# EAGLE schematic ClockMaster (EAGLE 7.7.0)
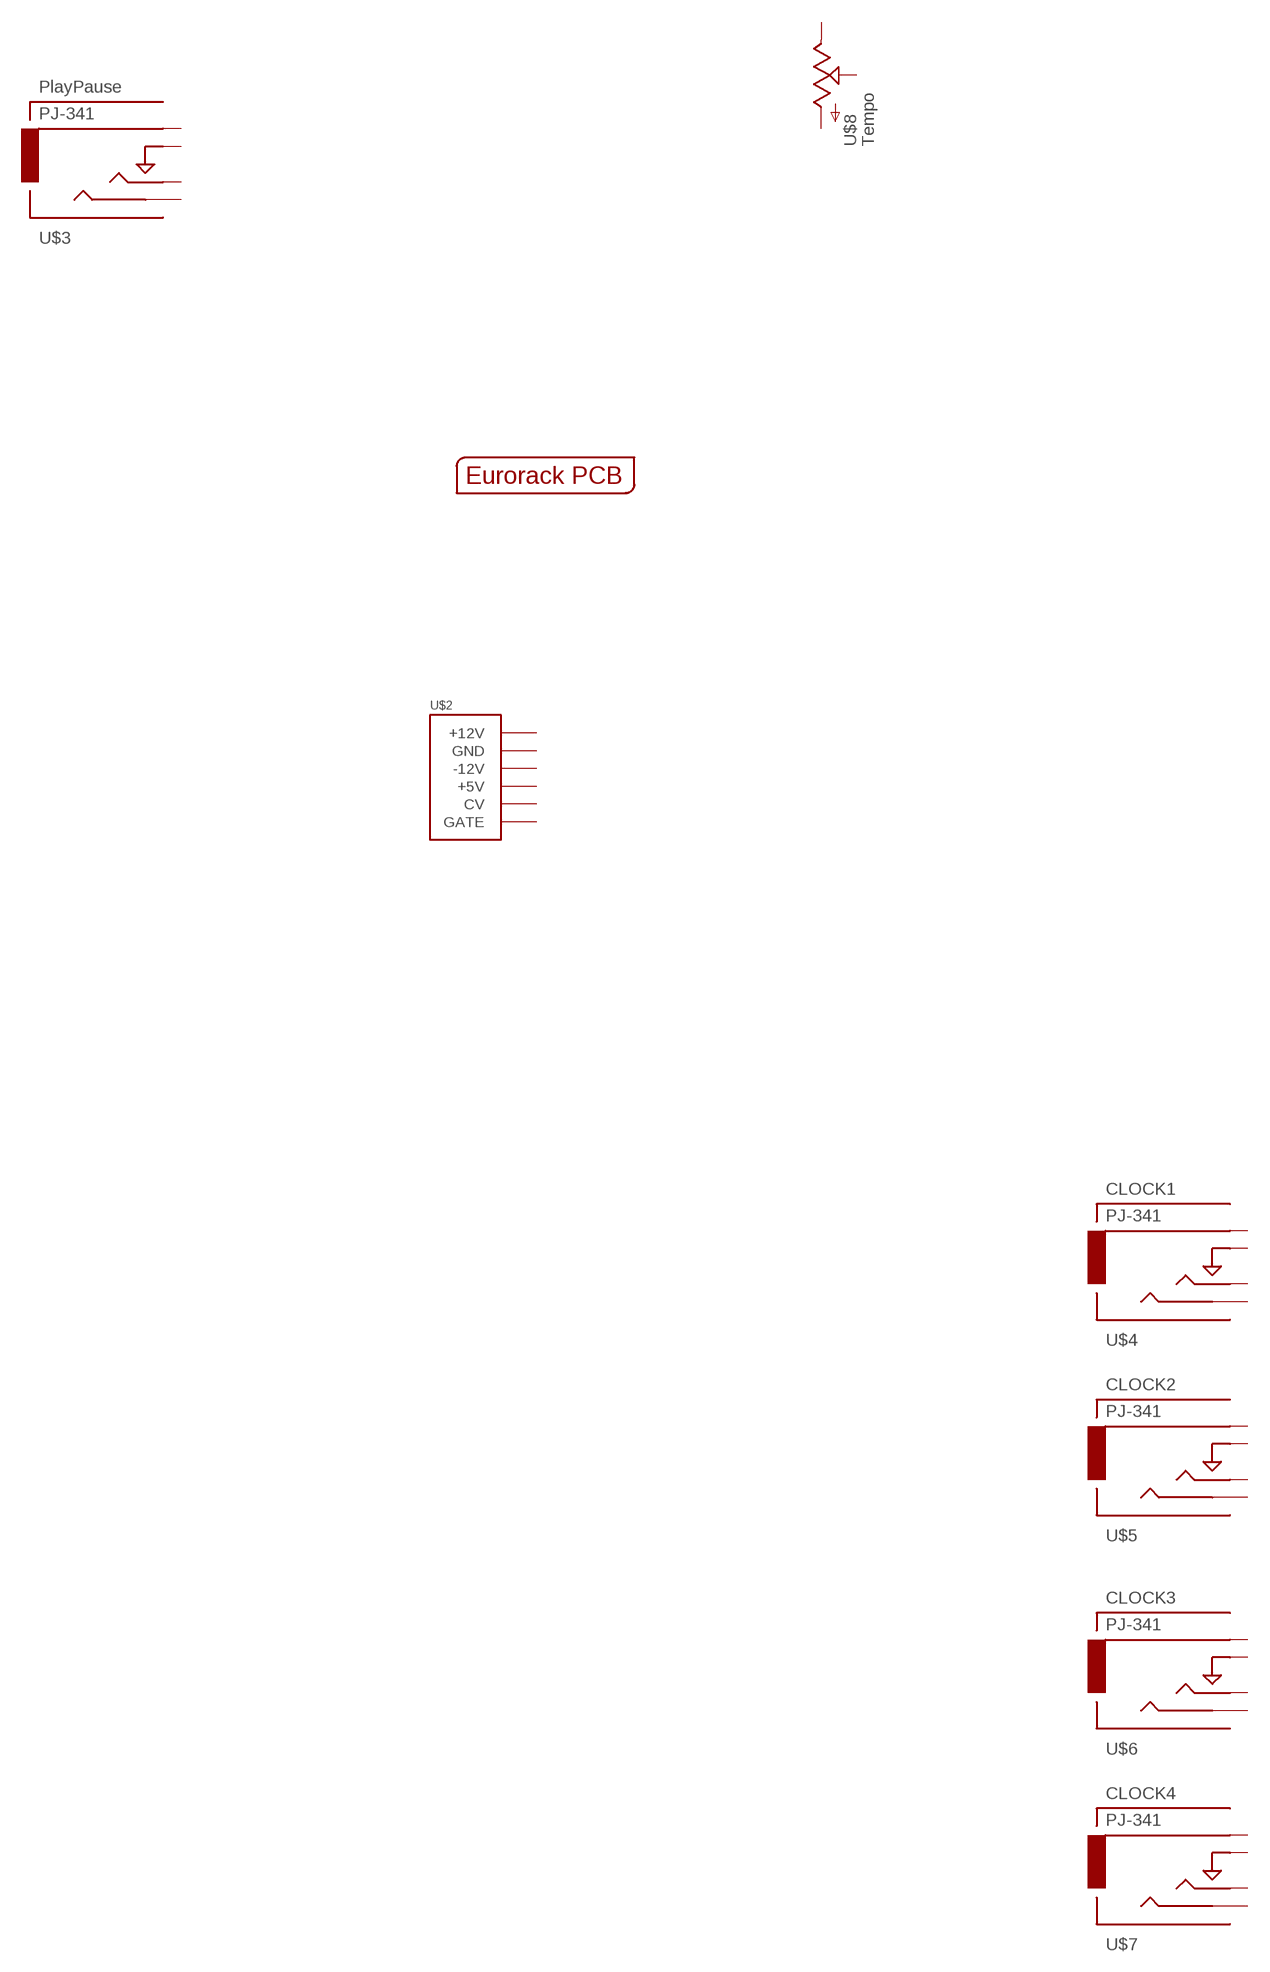
[diagram p0: schematic, sheet 1, part 1 of 2]
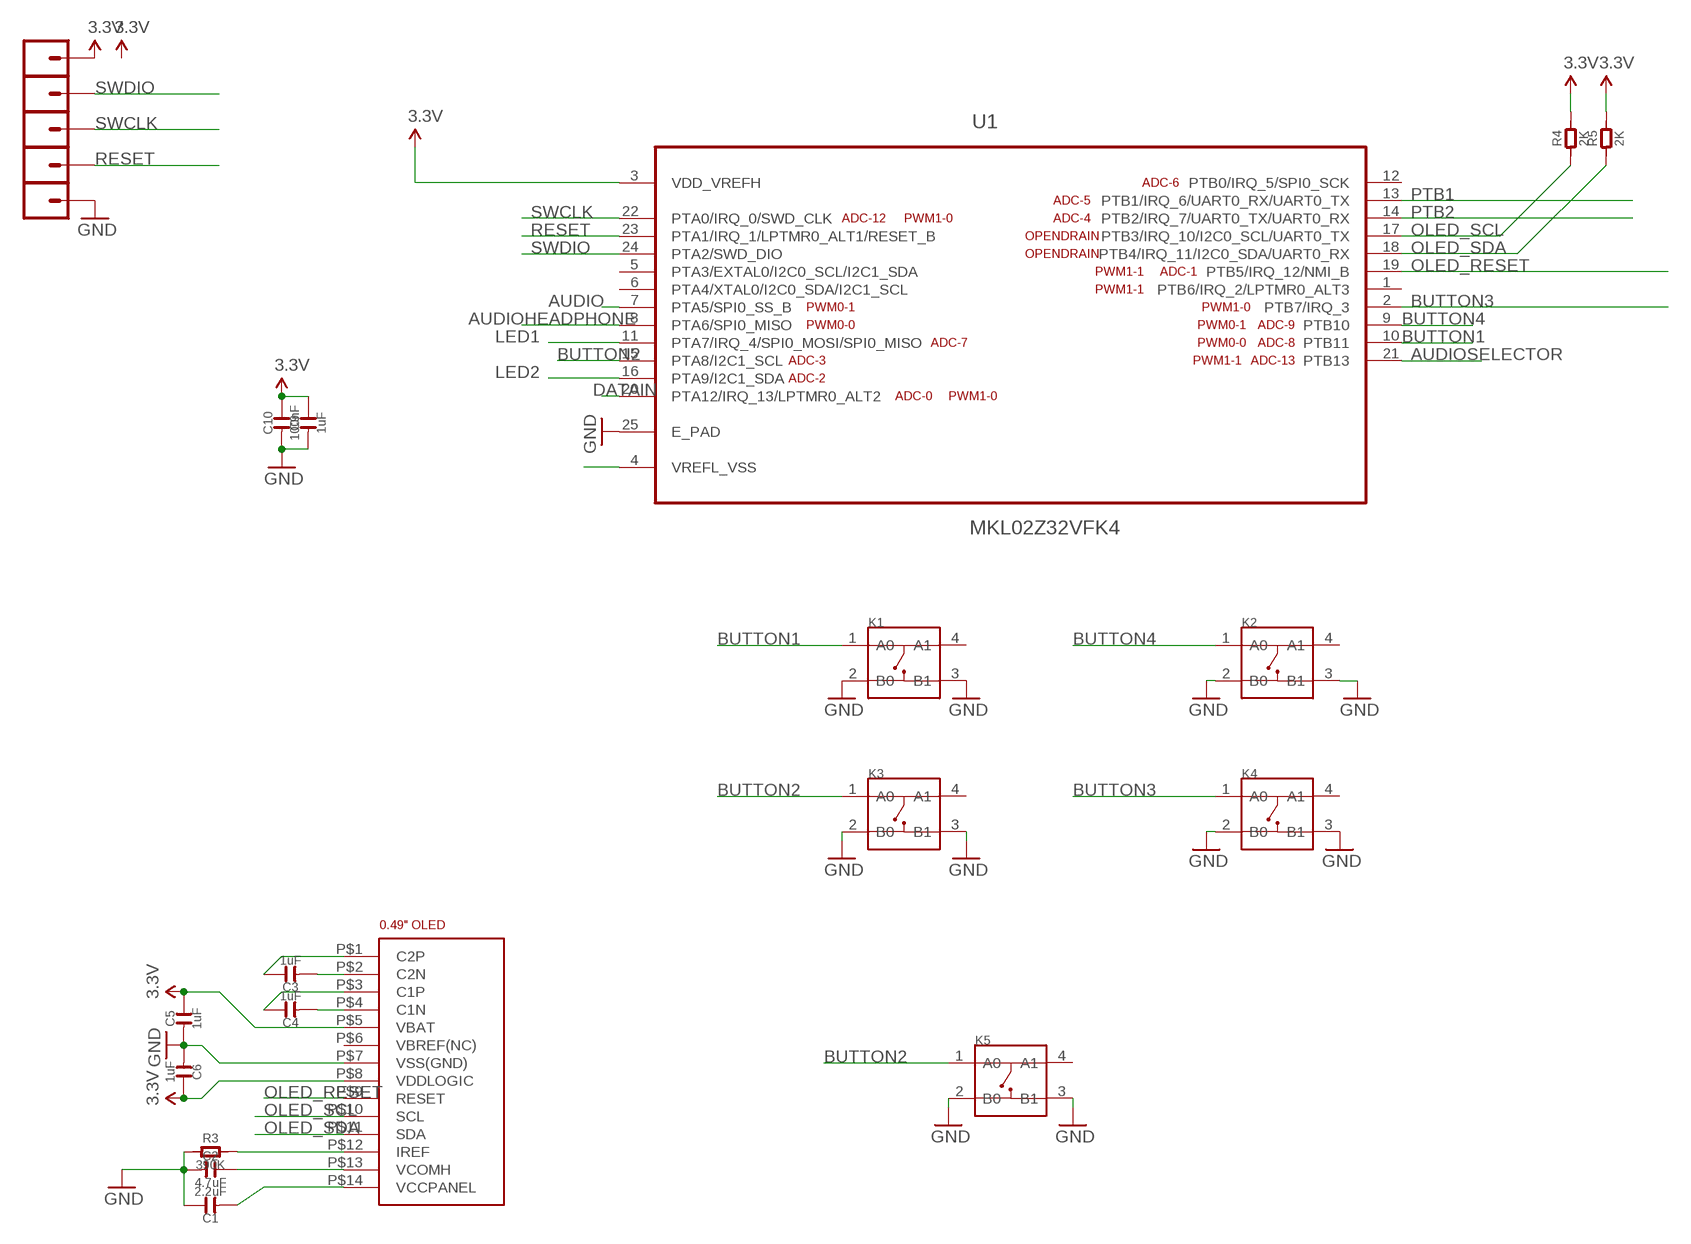
[diagram p1: schematic, sheet 1, part 2 of 2]

## Parts
C1  2.2uF  C-0603  [C0603]
C2  4.7uF  C-0603  [C0603]
C3  1uF  C-0603  [C0603]
C4  1uF  C-0603  [C0603]
C5  1uF  C-0603  [C0603]
C6  1uF  C-0603  [C0603]
C9  1uF  C-0603  [C0603]
C10  100nF  C-0603  [C0603]
K1  BUTTON-4P-3110040P1  [4P-6.0X6.0X5.0H]
K2  BUTTON-4P-3110040P1  [4P-6.0X6.0X5.0H]
K3  BUTTON-4P-3110040P1  [4P-6.0X6.0X5.0H]
K4  BUTTON-4P-3110040P1  [4P-6.0X6.0X5.0H]
K5  BUTTON-4P-3110040P1  [4P-6.0X6.0X5.0H]
PTA6_MISO1  M01SMD-4.5X1.5  [PAD-1.5X4.5]
PTA6_MISO2  M01SMD-4.5X1.5  [PAD-1.5X4.5]
PTA6_MISO3  M01SMD-4.5X1.5  [PAD-1.5X4.5]
PTA6_MISO4  M01SMD-4.5X1.5  [PAD-1.5X4.5]
PTA6_MISO5  M01SMD-4.5X1.5  [PAD-1.5X4.5]
R3  390K  R-0603  [R0603]
R4  2K  R-0603  [R0603]
R5  2K  R-0603  [R0603]
U1  MKL02Z32VFK4  [QFN50P400X400X100-25N]
U$1  EURORACK_PCB6HP  [EURORACK6HPPCB]
U$2  POWER  [POWER_16]
U$3  PJ-341  AUDIO-JACKINPUT  [3.5MM-JACK-SWITCH-13MM-INPUT]
U$4  PJ-341  AUDIO-JACKOUTPUT  [3.5MM-JACK-SWITCH-13MM-OUTPUT]
U$5  PJ-341  AUDIO-JACKOUTPUT  [3.5MM-JACK-SWITCH-13MM-OUTPUT]
U$6  PJ-341  AUDIO-JACKOUTPUT  [3.5MM-JACK-SWITCH-13MM-OUTPUT]
U$7  PJ-341  AUDIO-JACKOUTPUT  [3.5MM-JACK-SWITCH-13MM-OUTPUT]
U$8  POTZEPHPOT  [OG-POTS_ALPS_POT_VERTICAL]
U$9  0.49"OLEDFOLDED  [0.49"-FPC-0.7-14-FOLDED]

## Nets
3.3V: C5.2 C6.2 C9.2 C10.2 PTA6_MISO1.P$1 R4.2 R5.2 U1.3(VDD_VREFH) U$9.P$5(VBAT) U$9.P$8(VDDLOGIC)
AUDIO: U1.7(PTA5/SPI0_SS_B)
AUDIOHEADPHONE: U1.8(PTA6/SPI0_MISO)
AUDIOSELECTOR: U1.21(PTB13)
BUTTON1: K1.1(A0) U1.10(PTB11)
BUTTON2: K3.1(A0) K5.1(A0) U1.15(PTA8/I2C1_SCL)
BUTTON3: K4.1(A0) U1.2(PTB7/IRQ_3)
BUTTON4: K2.1(A0) U1.9(PTB10)
DATAIN: U1.20(PTA12/IRQ_13/LPTMR0_ALT2)
GND [GND]: C1.2 C2.1 C5.1 C6.1 C9.1 C10.1 K1.2(B0) K1.3(B1) K2.2(B0) K2.3(B1) K3.2(B0) K3.3(B1) K4.2(B0) K4.3(B1) K5.2(B0) K5.3(B1) PTA6_MISO5.P$1 R3.1 U1.25(E_PAD) U$9.P$7(VSS(GND))
LED1: U1.11(PTA7/IRQ_4/SPI0_MOSI/SPI0_MISO)
LED2: U1.16(PTA9/I2C1_SDA)
N$1 [GND]: U1.4(VREFL_VSS)
N$3: C3.2 U$9.P$1(C2P)
N$4: C4.2 U$9.P$3(C1P)
N$9: R3.2 U$9.P$12(IREF)
N$10: C1.1 U$9.P$14(VCCPANEL)
N$11: C2.2 U$9.P$13(VCOMH)
N$12: C3.1 U$9.P$2(C2N)
N$13: C4.1 U$9.P$4(C1N)
OLED_RESET: U1.19(PTB5/IRQ_12/NMI_B) U$9.P$9(RESET)
OLED_SCL: R4.1 U1.17(PTB3/IRQ_10/I2C0_SCL/UART0_TX) U$9.P$10(SCL)
OLED_SDA: R5.1 U1.18(PTB4/IRQ_11/I2C0_SDA/UART0_RX) U$9.P$11(SDA)
PTB1: U1.13(PTB1/IRQ_6/UART0_RX/UART0_TX)
PTB2: U1.14(PTB2/IRQ_7/UART0_TX/UART0_RX)
RESET: PTA6_MISO4.P$1 U1.23(PTA1/IRQ_1/LPTMR0_ALT1/RESET_B)
SWCLK: PTA6_MISO3.P$1 U1.22(PTA0/IRQ_0/SWD_CLK)
SWDIO: PTA6_MISO2.P$1 U1.24(PTA2/SWD_DIO)
Unconnected: K1.4(A1) K2.4(A1) K3.4(A1) K4.4(A1) K5.4(A1) U1.1(PTB6/IRQ_2/LPTMR0_ALT3) U1.5(PTA3/EXTAL0/I2C0_SCL/I2C1_SDA) U1.6(PTA4/XTAL0/I2C0_SDA/I2C1_SCL) U1.12(PTB0/IRQ_5/SPI0_SCK) U$2.1(-12V) U$2.2(-12V) U$2.3(GND) U$2.4(GND) U$2.5(GND) U$2.6(GND) U$2.7(GND) U$2.8(GND) U$2.9(+12V) U$2.10(+12V) U$2.11(+5V) U$2.12(+5V) U$2.13(CV) U$2.14(CV) U$2.15(GATE) U$2.16(GATE) U$3.RING@3(RING) U$3.SECOND@3(SECOND) U$3.SWITCH@3(SWITCH) U$3.TIP@3(TIP) U$4.RING@3(RING) U$4.SECOND@3(SECOND) U$4.SWITCH@3(SWITCH) U$4.TIP@3(TIP) U$5.RING@3(RING) U$5.SECOND@3(SECOND) U$5.SWITCH@3(SWITCH) U$5.TIP@3(TIP) U$6.RING@3(RING) U$6.SECOND@3(SECOND) U$6.SWITCH@3(SWITCH) U$6.TIP@3(TIP) U$7.RING@3(RING) U$7.SECOND@3(SECOND) U$7.SWITCH@3(SWITCH) U$7.TIP@3(TIP) U$8.P$1(E) U$8.P$2(S) U$8.P$3(A) U$9.P$6(VBREF(NC))

## Library data of the parts
C1-C6 C9 C10 = OPL:C*
K1-K5 = zephod-components:BUTTON-4P
PTA6_MISO1-PTA6_MISO5 = SparkFun-Connectors:M01: Header 1 Standard 1-pin 0.1" header. Use with straight break away headers (SKU : PRT-00116), right angle break away headers (PRT-00553), swiss pins (PRT-00743), machine pins (PRT-00117), and female headers (PRT-00115).
R3-R5 = OPL:R*
U1 = FarnellThings:MKL02Z32VFK4: IC, MCU, 32BIT, CORTEX M0+, 48MHZ, QFN-24; MPN: MKL02Z32VFK4; OC_FARNELL: 2321481; OC_NEWARK: 61W9887; PACKAGE: QFN-24; SUPPLIER: FREESCALE SEMICONDUCTOR
U$1 = EurorackModularParts:EURORACK_PCB
U$2 = EurorackModularParts:POWER
U$3 = EurorackModularParts:AUDIO-JACK: Switching Mono 3.5mm Audio Jack from Erthenvar.; DESC: PlayPause; MPN: PJ-341
U$4 = EurorackModularParts:AUDIO-JACK: Switching Mono 3.5mm Audio Jack from Erthenvar.; DESC: CLOCK1; MPN: PJ-341
U$5 = EurorackModularParts:AUDIO-JACK: Switching Mono 3.5mm Audio Jack from Erthenvar.; DESC: CLOCK2; MPN: PJ-341
U$6 = EurorackModularParts:AUDIO-JACK: Switching Mono 3.5mm Audio Jack from Erthenvar.; DESC: CLOCK3; MPN: PJ-341
U$7 = EurorackModularParts:AUDIO-JACK: Switching Mono 3.5mm Audio Jack from Erthenvar.; DESC: CLOCK4; MPN: PJ-341
U$8 = EurorackModularParts:POT; DESC: Tempo
U$9 = zephod-tft:0.49"OLED

## Net classes
0 default: clearance 0.178 mm
1 GND: width 0.203 mm, drill 0.203 mm, clearance 0.203 mm